# EAGLE design sequencer_uC (EAGLE 9.3.1)
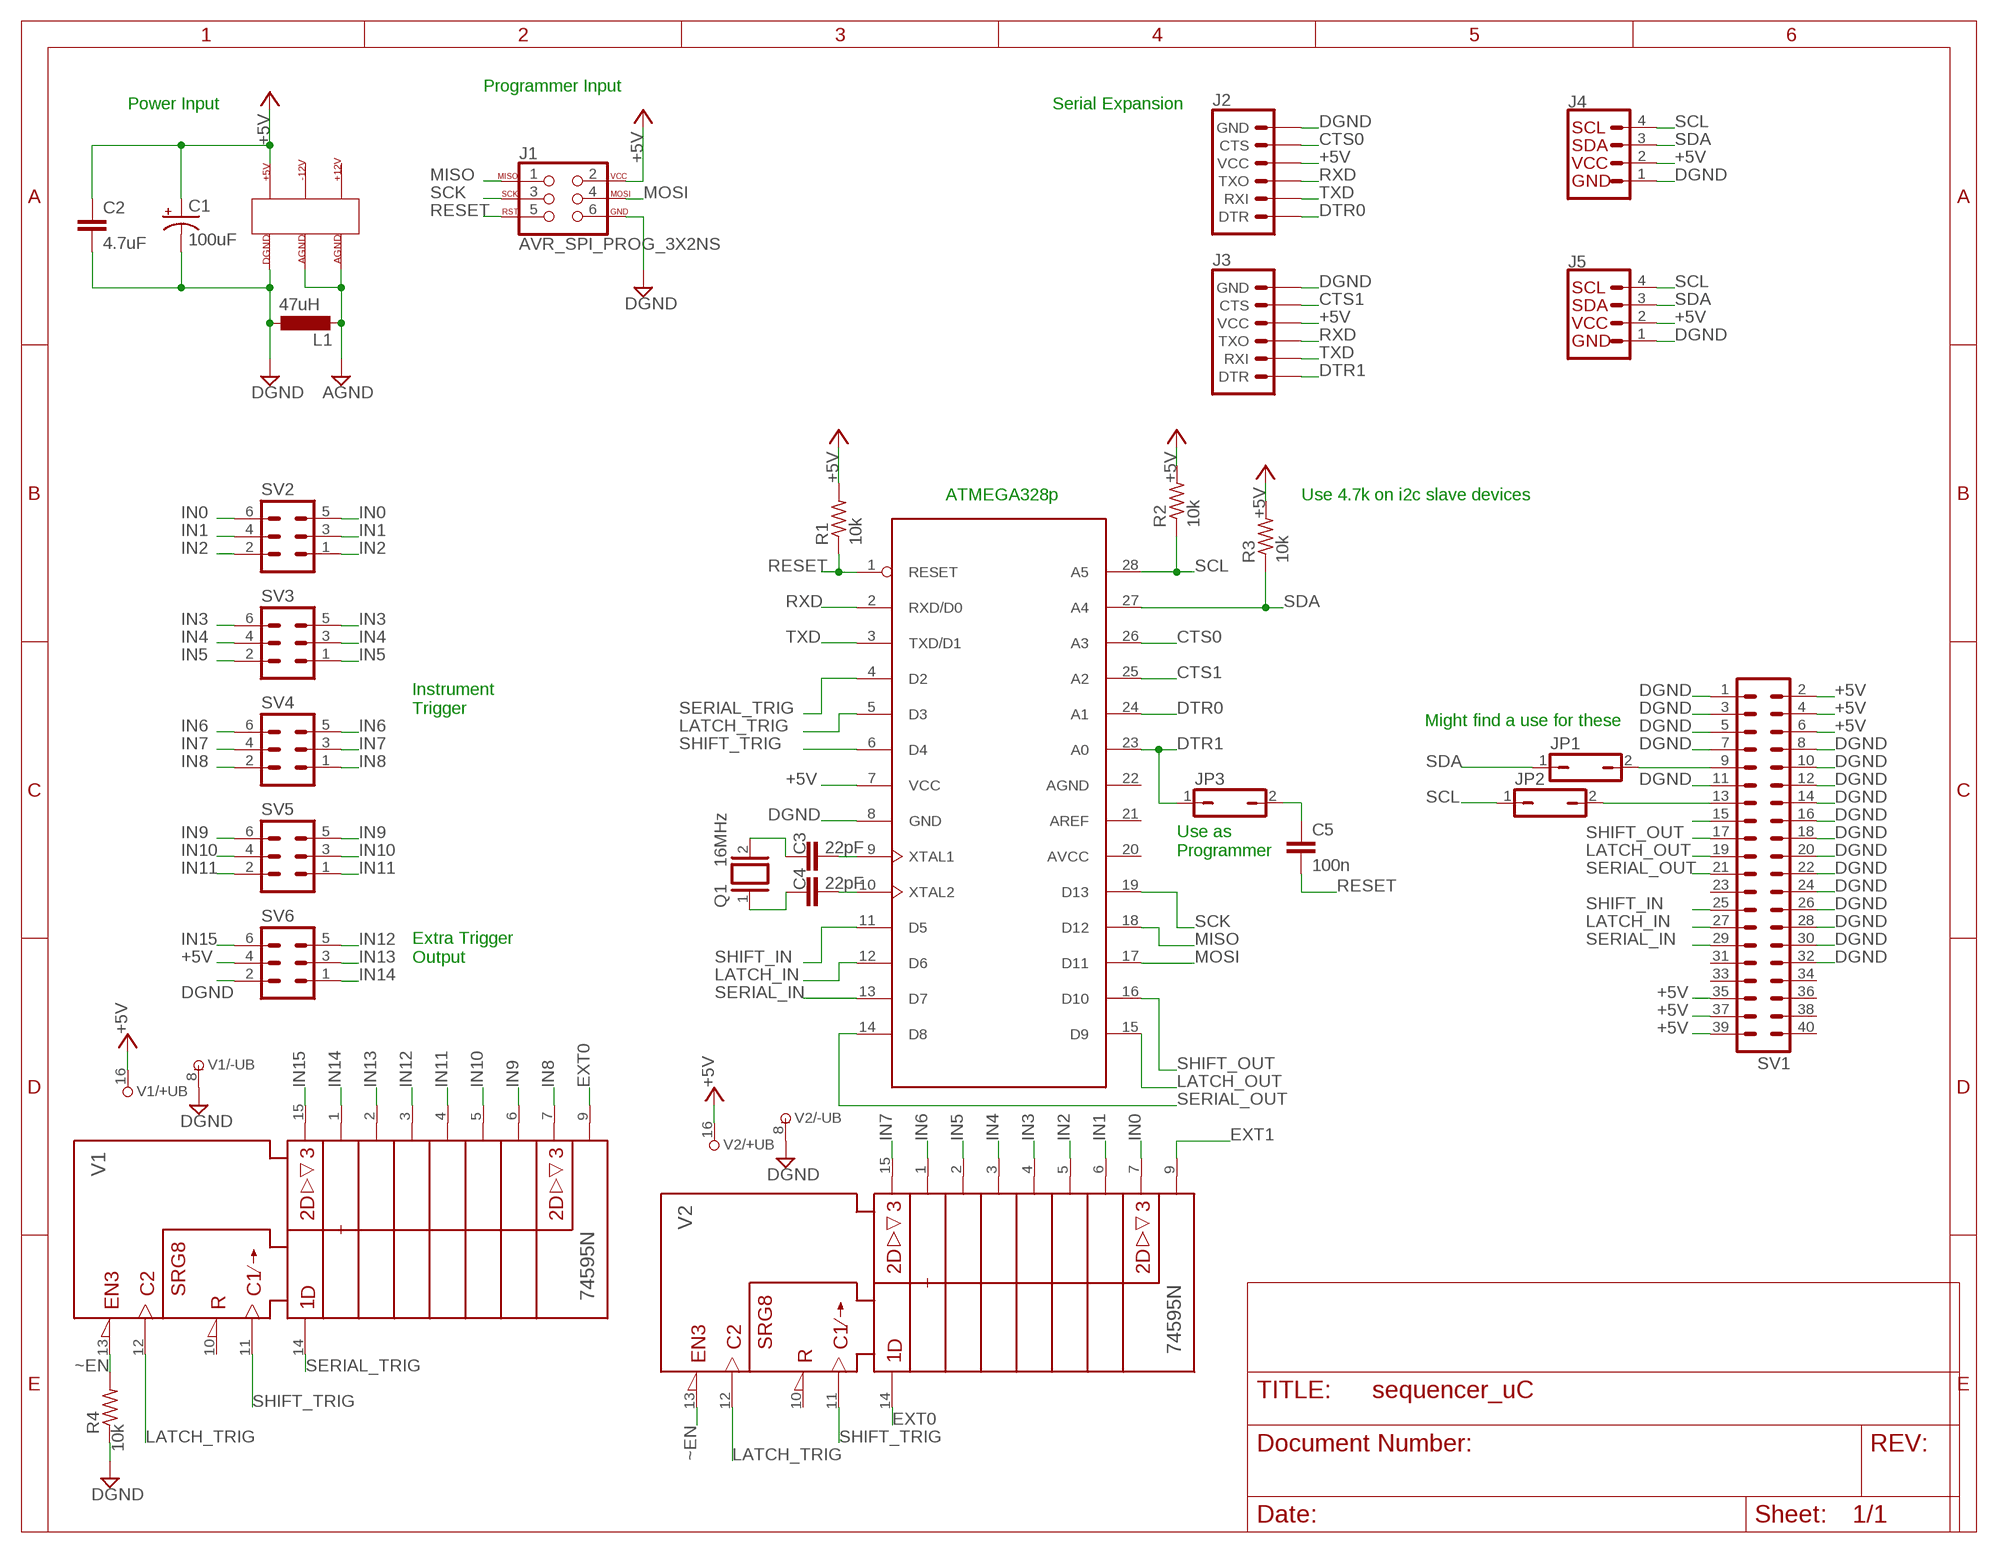
[diagram p0: schematic, sheet 1]

## Parts
AT1  ATMEGA328  [DIP28-0.3IN]
C1  100uF  CPOL-USE5-8.5  [E5-8,5]
C2  4.7uF  C-EU050-024X044  [C050-024X044]
C3  22pF  C-EU050-024X044  [C050-024X044]
C4  22pF  C-EU050-024X044  [C050-024X044]
C5  100n  C-EU050-024X044  [C050-024X044]
J1  AVR_SPI_PROG_3X2NS  [2X3-NS]
J2  6_PIN_SERIAL_TARGETLONGPADS  [1X06_LONGPADS]
J3  6_PIN_SERIAL_TARGETLONGPADS  [1X06_LONGPADS]
J4  I2C_STANDARD  [1X04]
J5  I2C_STANDARD  [1X04]
JP1  JP1Q  [JP1]
JP2  JP1Q  [JP1]
JP3  JP1Q  [JP1]
L1  47uH  L-EU0207/10  [0207/10]
Q1  16MHz  XTAL/S  [QS]
R1  10k  R-US_0204/7  [0204/7]
R2  10k  R-US_0204/7  [0204/7]
R3  10k  R-US_0204/7  [0204/7]
R4  10k  R-US_0204/7  [0204/7]
SV1  MA20-2  [MA20-2]
SV2  MA03-2  [MA03-2]
SV3  MA03-2  [MA03-2]
SV4  MA03-2  [MA03-2]
SV5  MA03-2  [MA03-2]
SV6  MA03-2  [MA03-2]
U$1  TER6PIN_VERT  [CAPSTONE_1-770875-0]
V1  74595N  [DIL16]
V2  74595N  [DIL16]

## Nets
+5V: AT1.7(VCC) C1.+ C2.1 J1.2 J2.4(VCC) J3.4(VCC) J4.2 J5.2 R1.2 R2.2 R3.2 SV1.2 SV1.4 SV1.6 SV1.35 SV1.37 SV1.39 SV6.4 U$1.+5V V1.16(+UB) V2.16(+UB)
AGND: L1.2 U$1.AGND0 U$1.AGND1
CTS0: AT1.26(A3) J2.5(CTS)
CTS1: AT1.25(A2) J3.5(CTS)
DGND: AT1.8(GND) C1.- C2.2 J1.6 J2.6(GND) J3.6(GND) J4.1 J5.1 L1.1 R4.1 SV1.1 SV1.3 SV1.5 SV1.7 SV1.8 SV1.10 SV1.11 SV1.12 SV1.14 SV1.15 SV1.16 SV1.18 SV1.20 SV1.22 SV1.24 SV1.26 SV1.28 SV1.30 SV1.32 SV6.2 U$1.DGND U$1.NULL(DGND) V1.8(-UB) V2.8(-UB)
DTR0: AT1.24(A1) J2.1(DTR)
DTR1: AT1.23(A0) J3.1(DTR) JP3.1
EXT0: V1.9(QH*) V2.14(SER)
EXT1: V2.9(QH*)
IN0: SV2.5 SV2.6 V2.7(QH)
IN1: SV2.3 SV2.4 V2.6(QG)
IN2: SV2.1 SV2.2 V2.5(QF)
IN3: SV3.5 SV3.6 V2.4(QE)
IN4: SV3.3 SV3.4 V2.3(QD)
IN5: SV3.1 SV3.2 V2.2(QC)
IN6: SV4.5 SV4.6 V2.1(QB)
IN7: SV4.3 SV4.4 V2.15(QA)
IN8: SV4.1 SV4.2 V1.7(QH)
IN9: SV5.5 SV5.6 V1.6(QG)
IN10: SV5.3 SV5.4 V1.5(QF)
IN11: SV5.1 SV5.2 V1.4(QE)
IN12: SV6.5 V1.3(QD)
IN13: SV6.3 V1.2(QC)
IN14: SV6.1 V1.1(QB)
IN15: SV6.6 V1.15(QA)
LATCH_IN: AT1.12(D6) SV1.27
LATCH_OUT: AT1.15(D9) SV1.19
LATCH_TRIG: AT1.5(D3) V1.12(RCK) V2.12(RCK)
MISO: AT1.18(D12) J1.1
MOSI: AT1.17(D11) J1.4
N$1: AT1.9(XTAL1) C3.2
N$2: AT1.10(XTAL2) C4.2
N$3: C3.1 Q1.2
N$4: C4.1 Q1.1
N$5: JP2.2 SV1.13
N$6: JP1.2 SV1.9
N$7: C5.1 JP3.2
RESET: AT1.1(RESET) C5.2 J1.5 R1.1
RXD: AT1.2(RXD/D0) J2.3(TXO) J3.3(TXO)
SCK: AT1.19(D13) J1.3
SCL: AT1.28(A5) J4.4 J5.4 JP2.1 R2.1
SDA: AT1.27(A4) J4.3 J5.3 JP1.1 R3.1
SERIAL_IN: AT1.13(D7) SV1.29
SERIAL_OUT: AT1.14(D8) SV1.21
SERIAL_TRIG: AT1.4(D2) V1.14(SER)
SHIFT_IN: AT1.11(D5) SV1.25
SHIFT_OUT: AT1.16(D10) SV1.17
SHIFT_TRIG: AT1.6(D4) V1.11(SRCK) V2.11(SRCK)
TXD: AT1.3(TXD/D1) J2.2(RXI) J3.2(RXI)
~EN: R4.2 V1.13(!G) V2.13(!G)
Unconnected: AT1.20(AVCC) AT1.21(AREF) AT1.22(AGND) SV1.23 SV1.31 SV1.33 SV1.34 SV1.36 SV1.38 SV1.40 U$1.+12V U$1.-12V V1.10(!SRCLR) V2.10(!SRCLR)

## Notes on the sheet
- Programmer Input
- Power Input | Serial Expansion
- ATMEGA328p | Use 4.7k on i2c slave devices
- Instrument
  Trigger
- Might find a use for these
- Use as
  Programmer
- Extra Trigger
  Output

## Library data of the parts
AT1 = atmega328p:ATMEGA328
C1 = rcl:CPOL-US: POLARIZED CAPACITOR, American symbol; SPICEPREFIX: C
C2-C5 = rcl:C-EU: CAPACITOR, European symbol; SPICEPREFIX: C
J1 = SparkFun-Connectors:AVR_SPI_PROG_3X2: AVR ISP 6 Pin This is the reduced ISP connector for AVR programming. Common on Arduino. This footprint will take up less PCB space and can be used with a 10-pin to 6-pin adapter such as SKU: BOB-08508 **Special note about "TEST_POINT" package. The stop mask is on the top side, so if you want your programming test points to be on the bottom of your board, make sure to place this package on the bottom side of the board. This also ensure that the orientation to program from the bottom side will be correct. SparkFun Products: SparkFun ISP Pogo Adapter <https://www.sparkfun.com/products/11591> - NS Tiny AVR Programmer <https://www.sparkfun.com/products/11801> -PTH
J2 J3 = SparkFun-Connectors:6_PIN_SERIAL_TARGET: 6-pin header connection for use with the "FTDI BASIC" pinout - TARGET SIDE. Also known as "Arduino Serial Program Header". It is used to mate with our FTDI Basic serial programmers using the Arduino IDE. Note, this device has "TARGET" in the name. It is intended to be used on a design that contains a target micro-controller that you wish to program. The "sister" device, named "CABLE" is inteneded to be used on a design that usually lives on the end of your USB cable and prvides the converter chip (FTDI232 or FTDI231x) to commnicate serial RX/TX. You can populate with some of these: Break Away Headers - Straight <https://www.sparkfun.com/products/116> (PRT-00116) For reference (or to suit your programming needs) check out these designs: SparkFun FTDI Basic Breakout - 5V <https://www.sparkfun.com/products/9716> (DEV-09716) SparkFun FTDI Basic Breakout - 3.3V <https://www.sparkfun.com/products/9873> (DEV-09873) SparkFun FTDI SmartBasic <https://www.sparkfun.com/products/12935> (DEV-12935) SparkFun Beefy 3 - FTDI Basic Breakout <https://www.sparkfun.com/products/13746> (DEV-13746)
J4 J5 = SparkFun-Connectors:I2C_STANDARD: SparkFun I2C Standard Pinout Header SparkFun has standardized on a pinout for all I2C based sensor breakouts. This pinout allows I2C boards to be plugged directly into the headers on Arduino Uno compatible boards, and to be daisy chained easily. Example SparkFun Products: SparkFun Atmospheric Sensor Breakout - BME280 <https://www.sparkfun.com/products/13676> SparkFun Altitude/Pressure Sensor Breakout - MPL3115A2 <https://www.sparkfun.com/products/11084> SparkFun TOF Range Finder Sensor - VL6180 <https://www.sparkfun.com/products/12785>
JP1-JP3 = jumper:JP1Q: JUMPER
L1 = rcl:L-EU: INDUCTOR, European symbol; SPICEPREFIX: L
Q1 = special:XTAL/S: CRYSTAL
R1 = resistor:R-US_: RESISTOR, American symbol
R2-R4 = rcl:R-US_: RESISTOR, American symbol; SPICEPREFIX: R
SV1 = con-lstb:MA20-2: PIN HEADER; OC_FARNELL: unknown; OC_NEWARK: unknown
SV2-SV6 = con-lstb:MA03-2: PIN HEADER; OC_FARNELL: unknown; OC_NEWARK: unknown
U$1 = TE6Pin:TER6PIN_VERT
V1 V2 = 74ttl-din:74*595: 8-bit SHIFT REGISTER, output latch

## Board
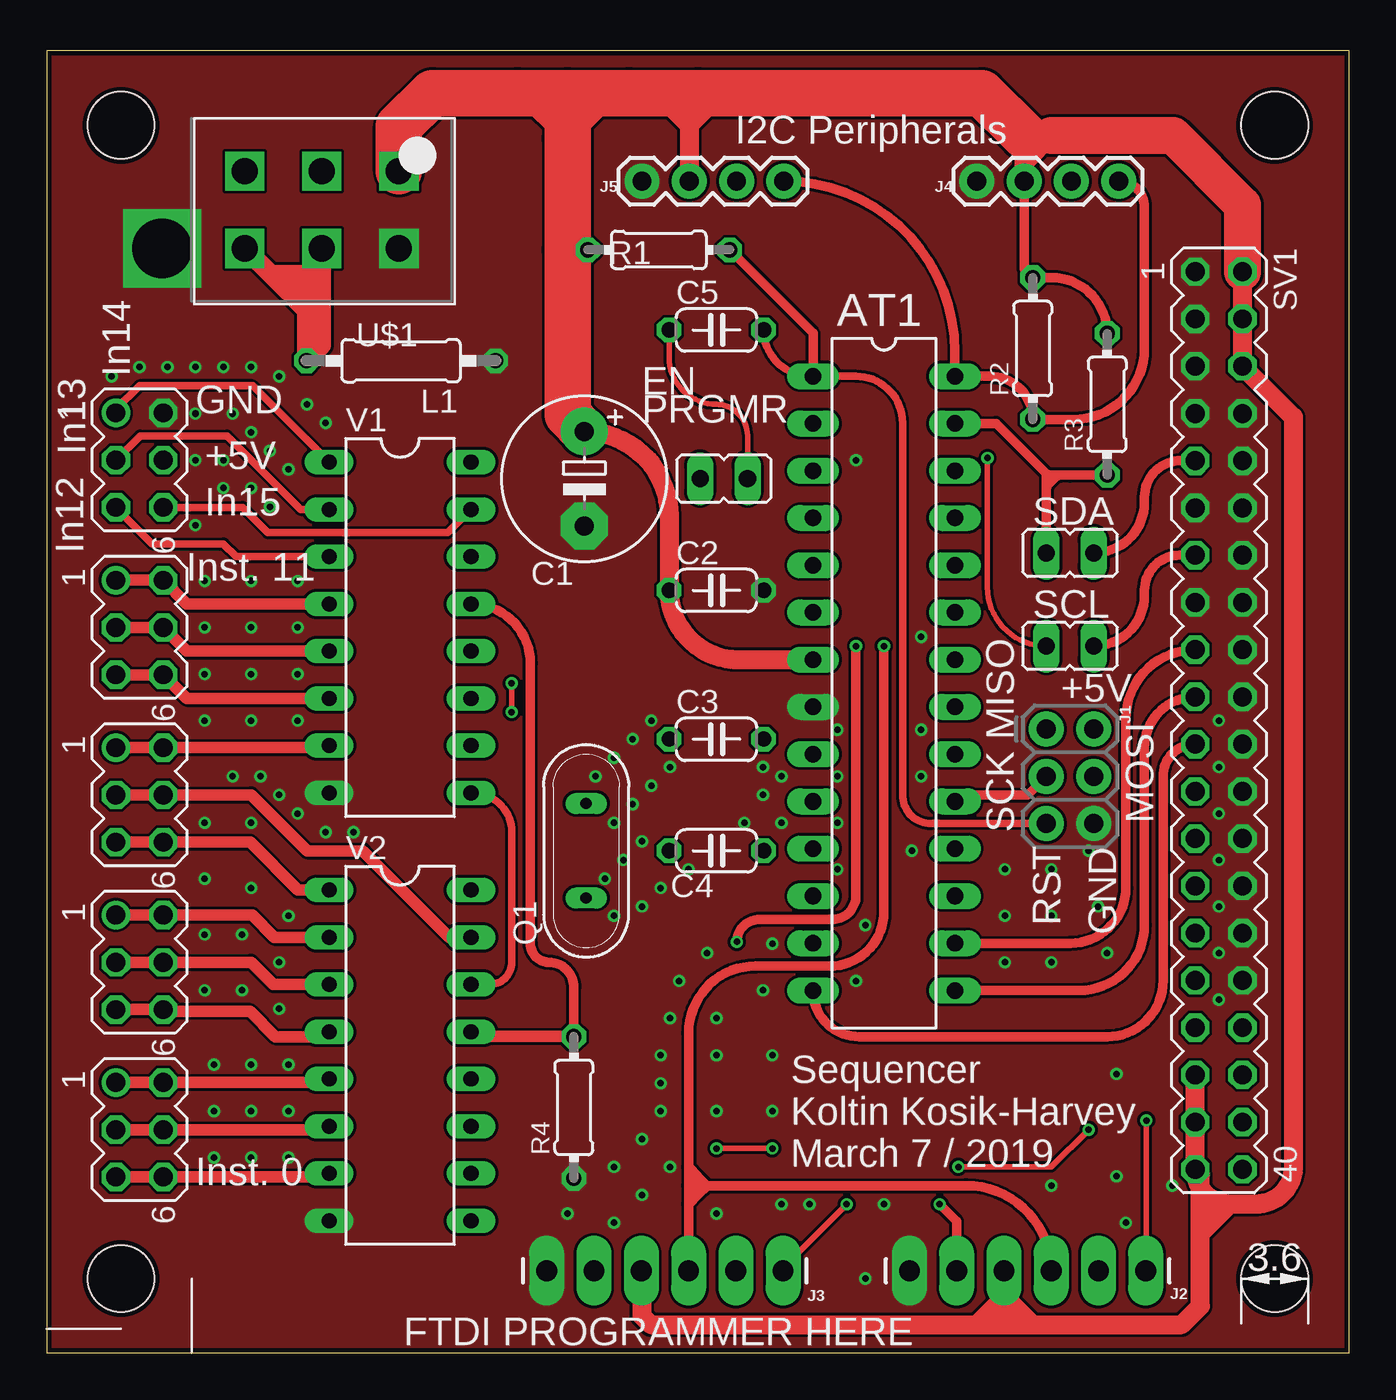
[diagram p1: board, top side]
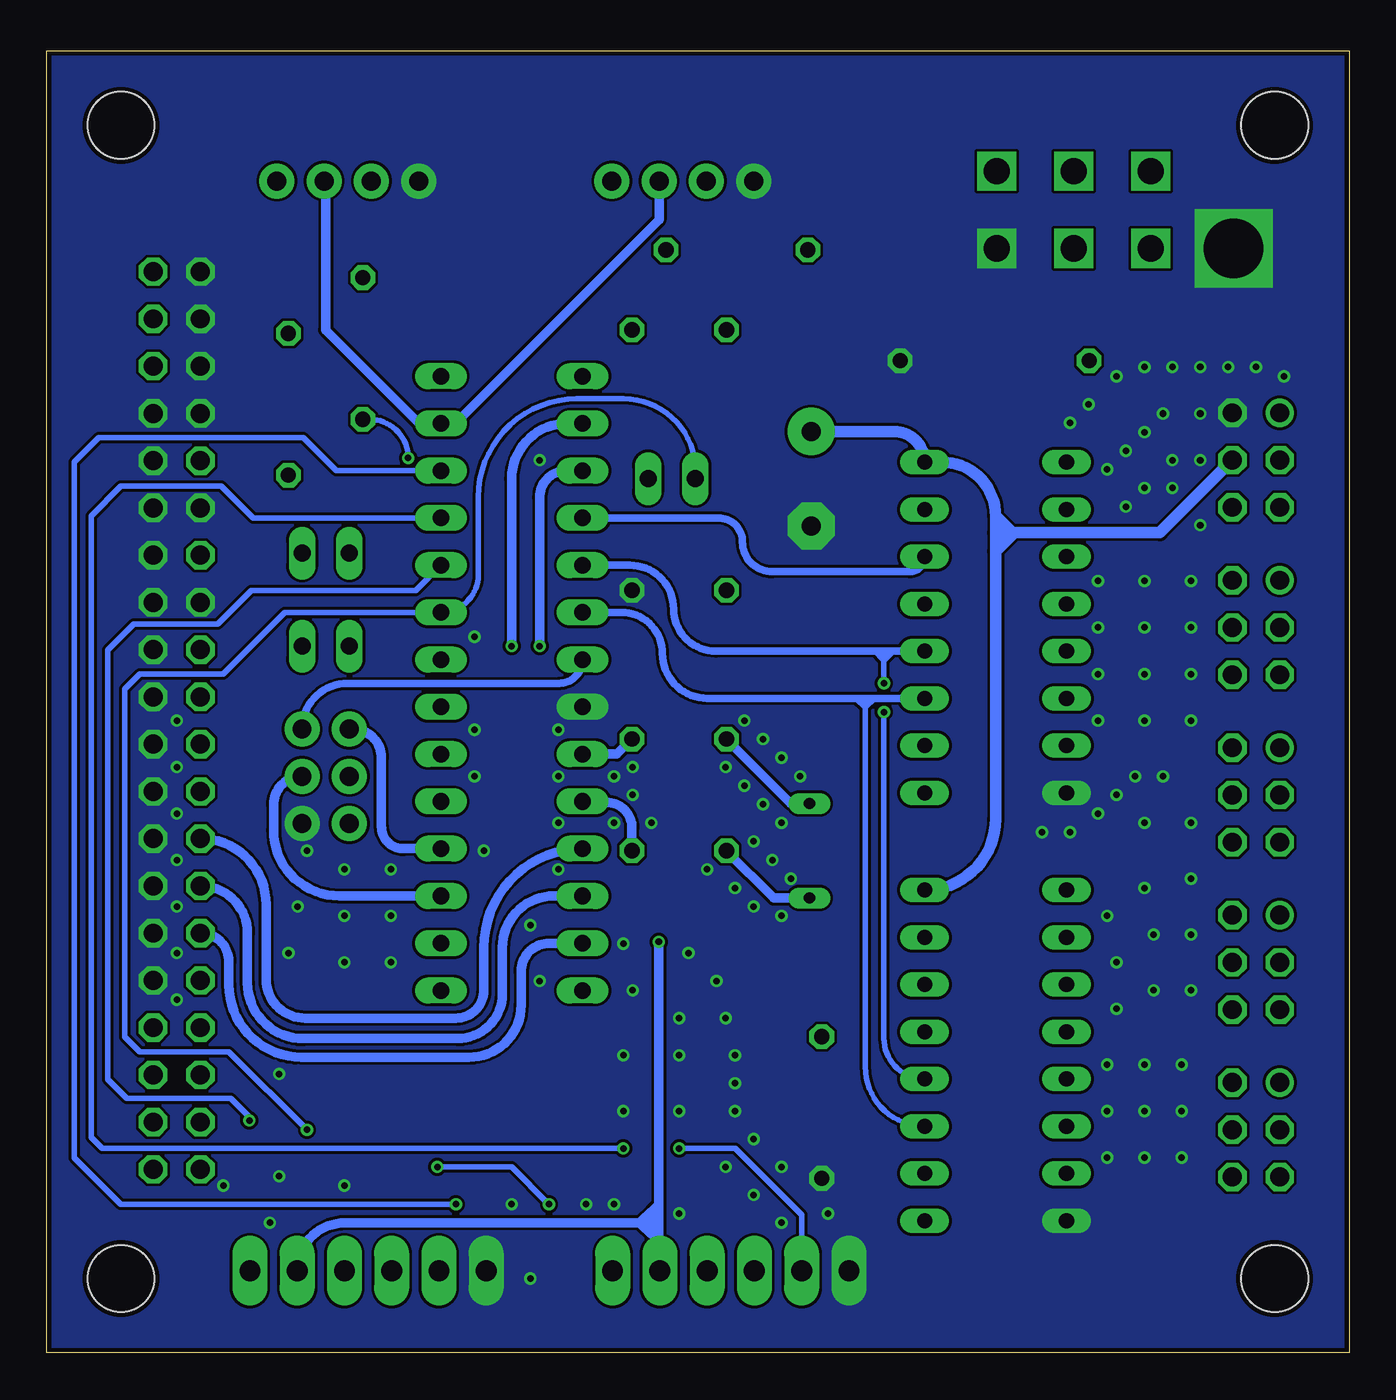
[diagram p2: board, bottom side, seen from below]

Size 70 x 70 mm. Coordinates in mm from the lower left corner, seen from the top.
Outline: 0,0 70,0 70,70 0,70 0,0
Copper layers (1*16): Top 0.035mm / dielectric 1.5mm / Bottom 0.035mm
Design rules "SeeedStudio_2layer_DRU_no_angle_20140221": minimum track width 6mil, minimum drill 12mil, track to track 6mil, track to pad 6mil, pad to pad 6mil, via to via 6mil, smd to smd 0mil, copper to edge 10mil, drill to drill 10mil, minimum pad ring 10mil, minimum via ring 6mil, stop-mask expansion 2mil, vias tented up to drill 100mil, thermal gap 10mil
Holes 3.6 mm at 4,4 66,4 66,66 4,66

### Footprints (pad centres in the part's own frame; a part is rotated, then mirrored left to right if it is on the bottom)
DIP28-0.3IN = drill 0.889 long: 1 -16.51,-3.81; 2 -13.97,-3.81; 3 -11.43,-3.81; 4 -8.89,-3.81; 5 -6.35,-3.81; 6 -3.81,-3.81; 7 -1.27,-3.81; 8 1.27,-3.81; 9 3.81,-3.81; 10 6.35,-3.81; 11 8.89,-3.81; 12 11.43,-3.81; 13 13.97,-3.81; 14 16.51,-3.81; 15 16.51,3.81; 16 13.97,3.81; 17 11.43,3.81; 18 8.89,3.81; 19 6.35,3.81; 20 3.81,3.81; 21 1.27,3.81; 22 -1.27,3.81; 23 -3.81,3.81; 24 -6.35,3.81; 25 -8.89,3.81; 26 -11.43,3.81; 27 -13.97,3.81; 28 -16.51,3.81
E5-8,5 = drill 1.016 pad 2.54: + -2.54,0 | drill 1.016 pad 2.54 octagon: - 2.54,0
C050-024X044 = drill 0.813 octagon: 1 -2.54,0; 2 2.54,0
2X3-NS = drill 1.016 pad 1.88: 1 -2.54,-1.27; 2 -2.54,1.27; 3 0,-1.27; 4 0,1.27; 5 2.54,-1.27; 6 2.54,1.27
1X06_LONGPADS = drill 1.118 pad 1.88 long: 1 0,0; 2 2.54,0; 3 5.08,0; 4 7.62,0; 5 10.16,0; 6 12.7,0
1X04 = drill 1.016 pad 1.88: 1 0,0; 2 2.54,0; 3 5.08,0; 4 7.62,0
JP1 = drill 0.914 long: 1 0,-1.27; 2 0,1.27
0207/10 = drill 0.813 octagon: 1 -5.08,0; 2 5.08,0
QS = drill 0.61 long: 1 -2.54,0; 2 2.54,0
0204/7 = drill 0.813 octagon: 1 -3.81,0; 2 3.81,0
MA20-2 = drill 1.016 octagon: 1 -24.13,-1.27; 2 -24.13,1.27; 3 -21.59,-1.27; 4 -21.59,1.27; 5 -19.05,-1.27; 6 -19.05,1.27; 7 -16.51,-1.27; 8 -16.51,1.27; 9 -13.97,-1.27; 10 -13.97,1.27; 11 -11.43,-1.27; 12 -11.43,1.27; 13 -8.89,-1.27; 14 -8.89,1.27; 15 -6.35,-1.27; 16 -6.35,1.27; 17 -3.81,-1.27; 18 -3.81,1.27; 19 -1.27,-1.27; 20 -1.27,1.27; 21 1.27,-1.27; 22 1.27,1.27; 23 3.81,-1.27; 24 3.81,1.27; 25 6.35,-1.27; 26 6.35,1.27; 27 8.89,-1.27; 28 8.89,1.27; 29 11.43,-1.27; 30 11.43,1.27; 31 13.97,-1.27; 32 13.97,1.27; 33 16.51,-1.27; 34 16.51,1.27; 35 19.05,-1.27; 36 19.05,1.27; 37 21.59,-1.27; 38 21.59,1.27; 39 24.13,-1.27; 40 24.13,1.27
MA03-2 = drill 1.016: 1 -2.54,-1.27 | drill 1.016 octagon: 2 -2.54,1.27; 3 0,-1.27; 4 0,1.27; 5 2.54,-1.27; 6 2.54,1.27
CAPSTONE_1-770875-0 = drill 1.4 square: +5V 0,-4.14; +12V 8.28,-4.14; -12V 4.14,-4.14; AGND0 4.14,0; AGND1 8.28,0; DGND 0,0 | drill 3.18 square: NULL 12.73,0
DIL16 = drill 0.813 long: 1 -8.89,-3.81; 2 -6.35,-3.81; 3 -3.81,-3.81; 4 -1.27,-3.81; 5 1.27,-3.81; 6 3.81,-3.81; 7 6.35,-3.81; 8 8.89,-3.81; 9 8.89,3.81; 10 6.35,3.81; 11 3.81,3.81; 12 1.27,3.81; 13 -1.27,3.81; 14 -3.81,3.81; 15 -6.35,3.81; 16 -8.89,3.81

### Placement (x,y rotation side)
AT1  45,36 270 top
C1  28.9,47 270 top
C2  36,41 0 top
C3  36,33 0 top
C4  36,27 0 top
C5  36,55 0 top
J1  55,31 270 top
J2  59.07,4.42 180 top
J3  39.58,4.42 180 top
J4  50,63 0 top
J5  32,63 0 top
JP1  55,43 270 top
JP2  55,38 270 top
JP3  36.4,47 270 top
L1  19.05,53.34 180 top
Q1  29,27 90 top
R1  32.9,59.3 180 top
R2  53,54 90 top
R3  57,51 90 top
R4  28.34,13.2 90 top
SV1  63,34 270 top
SV2  5,12 270 top
SV3  5,21 270 top
SV4  5,30 270 top
SV5  5,39 270 top
SV6  5,48 270 top
U$1  18.94,59.38 180 top
V1  19,39 270 top
V2  19,16 270 top

### Tracks (layer width: path | path; a pad name or v marks a point on that pad's centre or on a via)
+5V
  Top 0.508: R3.2 arc90 54,57.81 R2.2 52.54,58.27 J4.2
  Top 1.016: 35,67.73 34.54,67.27 34.54,66 | 34.54,66 J5.2 | 34.54,66 35.54,67 | 34.54,66 33.54,67 | R1.2 28,59.3 | SV1.2 SV1.4 SV1.6 67,50.32 67,10 arc-90 65,8 63.6,8 | 63.6,8 arc-90 SV1.39 | SV1.39 SV1.37 SV1.35 | C1.+ arc-90 33.46,44.98 C2.1 arc90 37.19,37.27 AT1.7 | 31.3,67.73 30.43,67.73 28,65.3 25.57,67.73 25.3,67.73 | J3.4 32,4.38 32,2 32.48,1.52 50,1.52 | 50,1.52 51.4,1.52 | 51.4,1.52 53,1.52 | 53,1.52 61,1.52 62,2.52 62,6.4 | SV1.39 62,9.6 62,7.7 | 62,6.4 62,7.7 | 63.6,8 63.3,7.7 | 63.3,7.7 62,7.7 | 63.3,7.7 62,6.4 | J2.4 51.45,3 | 51.45,2.97 51.45,1.57 51.4,1.52 | 53,1.52 51.52,3 51.45,3 | 50,1.52 51.45,2.97 | 51.45,2.97 51.45,3 | 52.54,65.46 J4.2 52.54,64 54,65.46 52.54,65.46
  Top 2: 54,65.46 60.54,65.46 64.27,61.73 SV1.2
  Top 2.5: 28,67.73 25.3,67.73 20.73,67.73 18.94,65.94 U$1.+5V | 28,67.73 31.3,67.73 35,67.73 50.27,67.73 52.54,65.46 | 28,67.73 28,65.3 28,59.3 28,50.44 C1.+
  Bottom 0.406: J1.2 arc90 53.81,36 42.46,36 arc-90 AT1.7
  Bottom 0.61: C1.+ 24.46,49.54 arc90 V1.16 21.89,47.89 arc90 19,45 | 19,45 19,44.1 | 19,44.1 19,43.1 | 19,43.1 19,28.7 arc90 V2.16 | SV6.4 10.17,44.1 18,44.1 | 18.1,44.1 19,44.1 | 18,44.1 18.1,44.1 | 18.1,44.1 19,45 | 18,44.1 19,43.1
AGND
  Top 1: 13.24,56.8 13.97,56.07 L1.2 14.8,54.17 14.8,56 | 13.02,57.02 12.04,58 | U$1.AGND1 12.02,58.02 12.04,58 | 14.8,56 14.8,56.8 | 14.8,56.8 U$1.AGND0 14.8,58.8 14,58 | 13.02,57.02 13.24,56.8 | 13.24,56.8 14.8,56.8 | 13.02,57.02 14,58 | 14.8,56 14,56.8 14,58 | 14,58 12.04,58
CTS0  (via drill 0.35)
  Top 0.508: J2.5 48.91,7.09 v48,8
  Bottom 0.305: AT1.26 54.43,47.43 56.2,49.2 67.2,49.2 68.5,47.9 68.5,10.5 66,8 v48,8
CTS1  (via drill 0.35)
  Top 0.305: v39,11 v36,11
  Bottom 0.305: AT1.25 58.89,44.89 60.6,46.6 66,46.6 67.6,45 67.6,11.6 67,11 v39,11 | v36,11 33,11 29.42,7.42 J3.5
DGND  (via drill 0.35)
  other vias: 44,4 45,8 39,13 36,13 33,13 33,16 34,20 39,22 36,16 39,16 46.5,27 47,31 47,33.5 47,38.5 43.5,48 42.5,31 42.5,33.5 42.5,28.5 42.5,26 51.5,21 54,21 57,21.5 51.5,23.5 54,23.5 56.5,24 51.5,26 54,26 56,27 63,29 63,31.5 63,34 63,26.5 63,24 63,21.5 63,19 57.5,15 57.5,9.5 60.5,9 58,7 54,9 39.5,8 41,8 36,7.5 30.5,7 32,8.5 33.5,10 32,11.5 30.5,10 28,7.5 33,14.5 33.5,18 36,18 35.5,21.5 38.5,19.5 43.5,20 44,23 30,25.5 31,26.5 32,27.5 30.5,23.5 32,24 33,25 34.5,26 30.5,28.5 31.5,29.5 32.5,30.5 33.5,31.5 29.5,31 30.5,32 31.5,33 32.5,34 38.5,31.5 39.5,31 37.5,28.5 38.5,30 39.5,28.5 8.5,19.5 10.5,19.5 12.5,18.5 12.5,21 10.5,22.5 8.5,22.5 8.5,25.5 11,25 13,23.5 8.5,28.5 11,28.5 15,28 13.5,29 12.5,30 11.5,31 10,31 16.5,28 8.5,34 11,34 13.5,34 13.5,36.5 11,36.5 8.5,36.5 8.5,39 11,39 13.5,39 13.5,41.5 11,41.5 8.5,41.5 8,44.5 9.5,46.5 11,46.5 12,45.5 9.5,48 8,48 8,50.5 10,50.5 11,49.5 12,48.5 13,47.5 15,50 14,51 12.5,52.5 11,53 9.5,53 8,53 6.5,53 5,53 3.5,52.5 13,15.5 11,15.5 9,15.5 9,13 11,13 13,13 9,10.5 11,10.5 13,10.5
  pour Top (no thermals): -1,71 71,71 71,-1 -1,-1
  pour Bottom (no thermals): -2,72 72,72 72,-2 -2,-2
DTR0  (via drill 0.35)
  Top 0.305: v59.1,12.5 59.1,4.45 J2.1
  Bottom 0.305: AT1.24 50.16,41 59,41 60.8,39.2 65.3,39.2 66.7,37.8 66.7,14.7 65.7,13.7 60.1,13.7 59.1,12.7 v59.1,12.5
DTR1  (via drill 0.35)
  Top 0.305: v56,12 54,10 v49,10 | v43,8 39.58,4.58 J3.1
  Bottom 0.305: v56,12 60.2,16.2 65,16.2 65.8,17 65.8,35.7 65,36.5 60.5,36.5 57.19,39.81 AT1.23 arc-90 46.8,41.82 46.8,46 arc90 41.5,51.3 39,51.3 arc90 35.13,47.43 JP3.1 | v49,10 45,10 v43,8
EXT0
  Top 0.406: V1.9 22.89,30.11 arc-90 25,28 25,21 arc-90 23.81,19.81 V2.14
IN0
  Top 0.61: V2.7 15,9.46 SV2.6 SV2.5
IN1
  Top 0.61: SV2.3 SV2.4 15,12 V2.6
IN2
  Top 0.61: SV2.1 SV2.2 15,14.54 V2.5
IN3
  Top 0.61: V2.4 14.92,17 12.3,17 10.94,18.36 6.37,18.36 SV3.6 SV3.5
IN4
  Top 0.61: V2.3 12.19,19.81 11,21 SV3.4 SV3.3
IN5
  Top 0.61: SV3.1 SV3.2 11.06,23.54 12.25,22.35 V2.2
IN6
  Top 0.61: SV4.5 SV4.6 10.94,27.46 13.51,24.89 V2.1
IN7
  Top 0.61: SV4.3 SV4.4 11,30 14,27 17,27 21.65,22.35 V2.15
IN8
  Top 0.61: V1.7 15.08,32.54 SV4.2 SV4.1
IN9
  Top 0.61: V1.6 7.54,35.19 SV5.6 SV5.5
IN10
  Top 0.61: V1.5 7.54,37.73 SV5.4 SV5.3
IN11
  Top 0.61: V1.4 7.54,40.27 SV5.2 SV5.1
IN12
  Top 0.406: SV6.5 5.69,43.5 9.5,43.5 10.19,42.81 V1.3
IN13
  Top 0.406: SV6.3 5.03,49.3 9.7,49.3 13.65,45.35 V1.2
IN14
  Top 0.406: V1.1 11.08,52 5,52 3.73,50.73 SV6.1
IN15
  Top 0.406: SV6.6 10.54,45.46 11.9,44.1 21.56,44.1 V1.15
LATCH_IN
  Bottom 0.508: AT1.12 42.73,24.57 arc-90 45.5,21.8 45.5,19.3 arc90 47.9,16.9 56.2,16.9 arc90 59.2,19.9 59.2,22.58 arc-90 SV1.27
LATCH_OUT
  Top 0.508: AT1.15 55.49,19.49 arc90 59,23 59,32.54 arc-90 SV1.19
LATCH_TRIG  (via drill 0.35)
  Top 0.305: v25,36 v25,34.46
  Bottom 0.305: v25,34.46 25,16.92 arc-90 V2.12 | v25,36 25,37.23 | 25,37.23 25,37.73 | 25,37.23 arc-90 25.5,37.73 25,37.23 | 25,37.23 arc90 24.5,37.73 25,37.23
  Bottom 0.406: V1.12 24.5,37.73 25,37.73 25.5,37.73 34.03,37.73 arc90 36.3,40 arc-90 38.65,42.35 AT1.5
MISO
  Bottom 0.508: AT1.18 50.81,27.11 arc90 52,28.3 52,32 arc-90 53.54,33.54 J1.1
MOSI
  Bottom 0.508: AT1.17 54.27,24.57 arc90 57.8,28.1 57.8,29.47 arc90 J1.4
N$1
  Bottom 0.508: C3.2 39.35,32.19 AT1.9
N$2
  Bottom 0.508: C4.2 38.54,28.24 arc-90 39.9,29.6 41.14,29.6 arc90 AT1.10
N$3
  Bottom 0.508: Q1.2 30,29.54 C3.1
N$4
  Bottom 0.508: C4.1 30.92,24.46 Q1.1
N$5
  Top 0.508: JP2.2 arc90 59,40.73 59,41 arc-90 60.89,42.89 SV1.13
N$6
  Top 0.508: JP1.2 arc90 59,45.73 59,46 arc-90 60.97,47.97 SV1.9
N$7
  Top 0.305: C5.1 33.46,53.54 arc90 36,51 arc-90 37.67,49.33 JP3.2
RESET
  Top 0.406: J1.5 47.54,28.46 arc-90 46,30 46,50 arc90 43.49,52.51 AT1.1 41.03,52.51 arc-90 C5.2
  Top 0.508: AT1.1 41.19,54.82 R1.1
RXD  (via drill 0.35)
  Top 0.508: v45,38 45,23.7 arc-90 42.1,20.8 38.1,20.8 arc90 34.5,17.2 34.5,10 | 34.5,10 34.5,9 | 34.5,9 34.5,8 | 34.5,8 J3.3 | 34.5,9 35,9 | 35,9 35.5,9 | 35.5,9 49.41,9 arc-90 J2.3 | 34.5,10 35,9.5 | 35,9.5 35,9 | 34.5,8 35,8.5 | 35,8.5 35,9 | 35,9.5 35.5,9 | 35,8.5 35.5,9
  Bottom 0.508: AT1.2 42.03,49.97 arc-90 45,47 v45,38
SCK
  Top 0.508: AT1.19 49.16,30 52.73,30 J1.3
SCL  (via drill 0.35)
  Top 0.305: JP2.1 arc-90 50.56,41.17 v50.56,48.11
  Top 0.508: J5.4 arc-90 48.81,53.81 AT1.28 50.68,52.51 arc-90 R2.1 55.19,50.19 arc90 59,54 59,61.62 arc90 J4.4
  Bottom 0.305: v50.56,48.11 arc-90 52.64,50.19 R2.1
SDA
  Top 0.305: 53.73,46 arc-90 54.92,47.19 55,47.19
  Top 0.508: AT1.27 51.03,49.97 53.73,47.27 | 53.73,47.27 53.73,46 JP1.1 | R3.1 55,47.19 54.5,47.19 53.81,47.19 53.73,47.27
  Bottom 0.508: J4.3 55,62.92 55,55 49.97,49.97 AT1.27 48.03,49.97 37.08,60.92 J5.3
SERIAL_IN
  Bottom 0.508: AT1.13 42.97,22.03 arc-90 44.5,20.5 44.5,18.7 arc90 47.3,15.9 56.3,15.9 arc90 60.2,19.8 60.2,21.04 arc-90 SV1.29
SERIAL_OUT
  Top 0.508: AT1.14 arc90 43.68,17 57,17 arc90 60,20 60,31 arc-90 SV1.21
SERIAL_TRIG
  Bottom 0.406: V1.14 arc90 23.62,42 31,42 arc90 32.6,43.6 arc-90 33.89,44.89 AT1.4
SHIFT_IN
  Bottom 0.508: AT1.11 arc-90 46.5,21.8 46.5,19.5 arc90 48,18 56.1,18 arc90 58.2,20.1 58.2,24.12 arc-90 SV1.25
SHIFT_OUT
  Top 0.508: AT1.16 55.03,22.03 arc90 58,25 58,34.08 arc-90 SV1.17
SHIFT_TRIG
  Bottom 0.305: 26,35.19 26,34.69 | 26,34.69 26,15.38 arc-90 V2.11 | 26,34.69 arc-90 26.5,35.19 26,34.69 | 26,34.69 arc90 25.5,35.19 26,34.69
  Bottom 0.406: V1.11 25.5,35.19 26,35.19 26.5,35.19 34.49,35.19 arc90 36.9,37.6 arc-90 39.11,39.81 AT1.6
TXD  (via drill 0.35)
  Top 0.508: v43.5,38 43.5,24.6 arc-90 42.2,23.3 38.3,23.3 arc90 v37.1,22.1
  Bottom 0.508: AT1.3 42.07,47.43 arc-90 43.5,46 v43.5,38 | v37.1,22.1 37.1,8 | 37.1,8 37.1,7 | 37.1,7 37.1,6 | 37.1,6 37.1,4.48 arc-90 J3.2 | 37.5,7 38,7 | 38,7 53.95,7 arc-90 J2.2 | 37.5,7 37.1,7 | 37.1,8 37.5,7.6 | 37.5,7.6 37.5,7 | 37.1,6 37.5,6.4 | 37.5,6.4 37.5,7 | 38,7 38,7.1 37.5,7.6 | 38,7 38,6.9 37.5,6.4
~EN
  Top 0.508: R4.2 28.34,19.66 arc90 27,21 arc-90 26,22 26,37.08 arc90 V1.13
  Top 0.61: V2.13 23.07,17.01 R4.2

### Text on the board
tPlace: I2C Peripherals | In14 | GND | EN / PRGMR | In13 | +5V | In15 | SDA | In12 | Inst. 11 | SCL | +5V | MISO | SCK | MOSI | RST | GND | Sequencer / Koltin Kosik-Harvey / March 7 / 2019 | Inst. 0 | FTDI PROGRAMMER HERE